# EasyEDA Pro project ProPrj_DiscoTech 6 Current_2026-05-06.epro, schematic Control_Manual_Mute

## Sheets
1 P1: Board Name: Control_Manual_Mute; Create Date: 2026-05-04; Page Name: P1; Project Name: DiscoTech 6 Current; Schematic Name: Control_1; Update Date: 2026-05-04; Company: EasyEDA.com; Page Size: A4; Version: V1.0
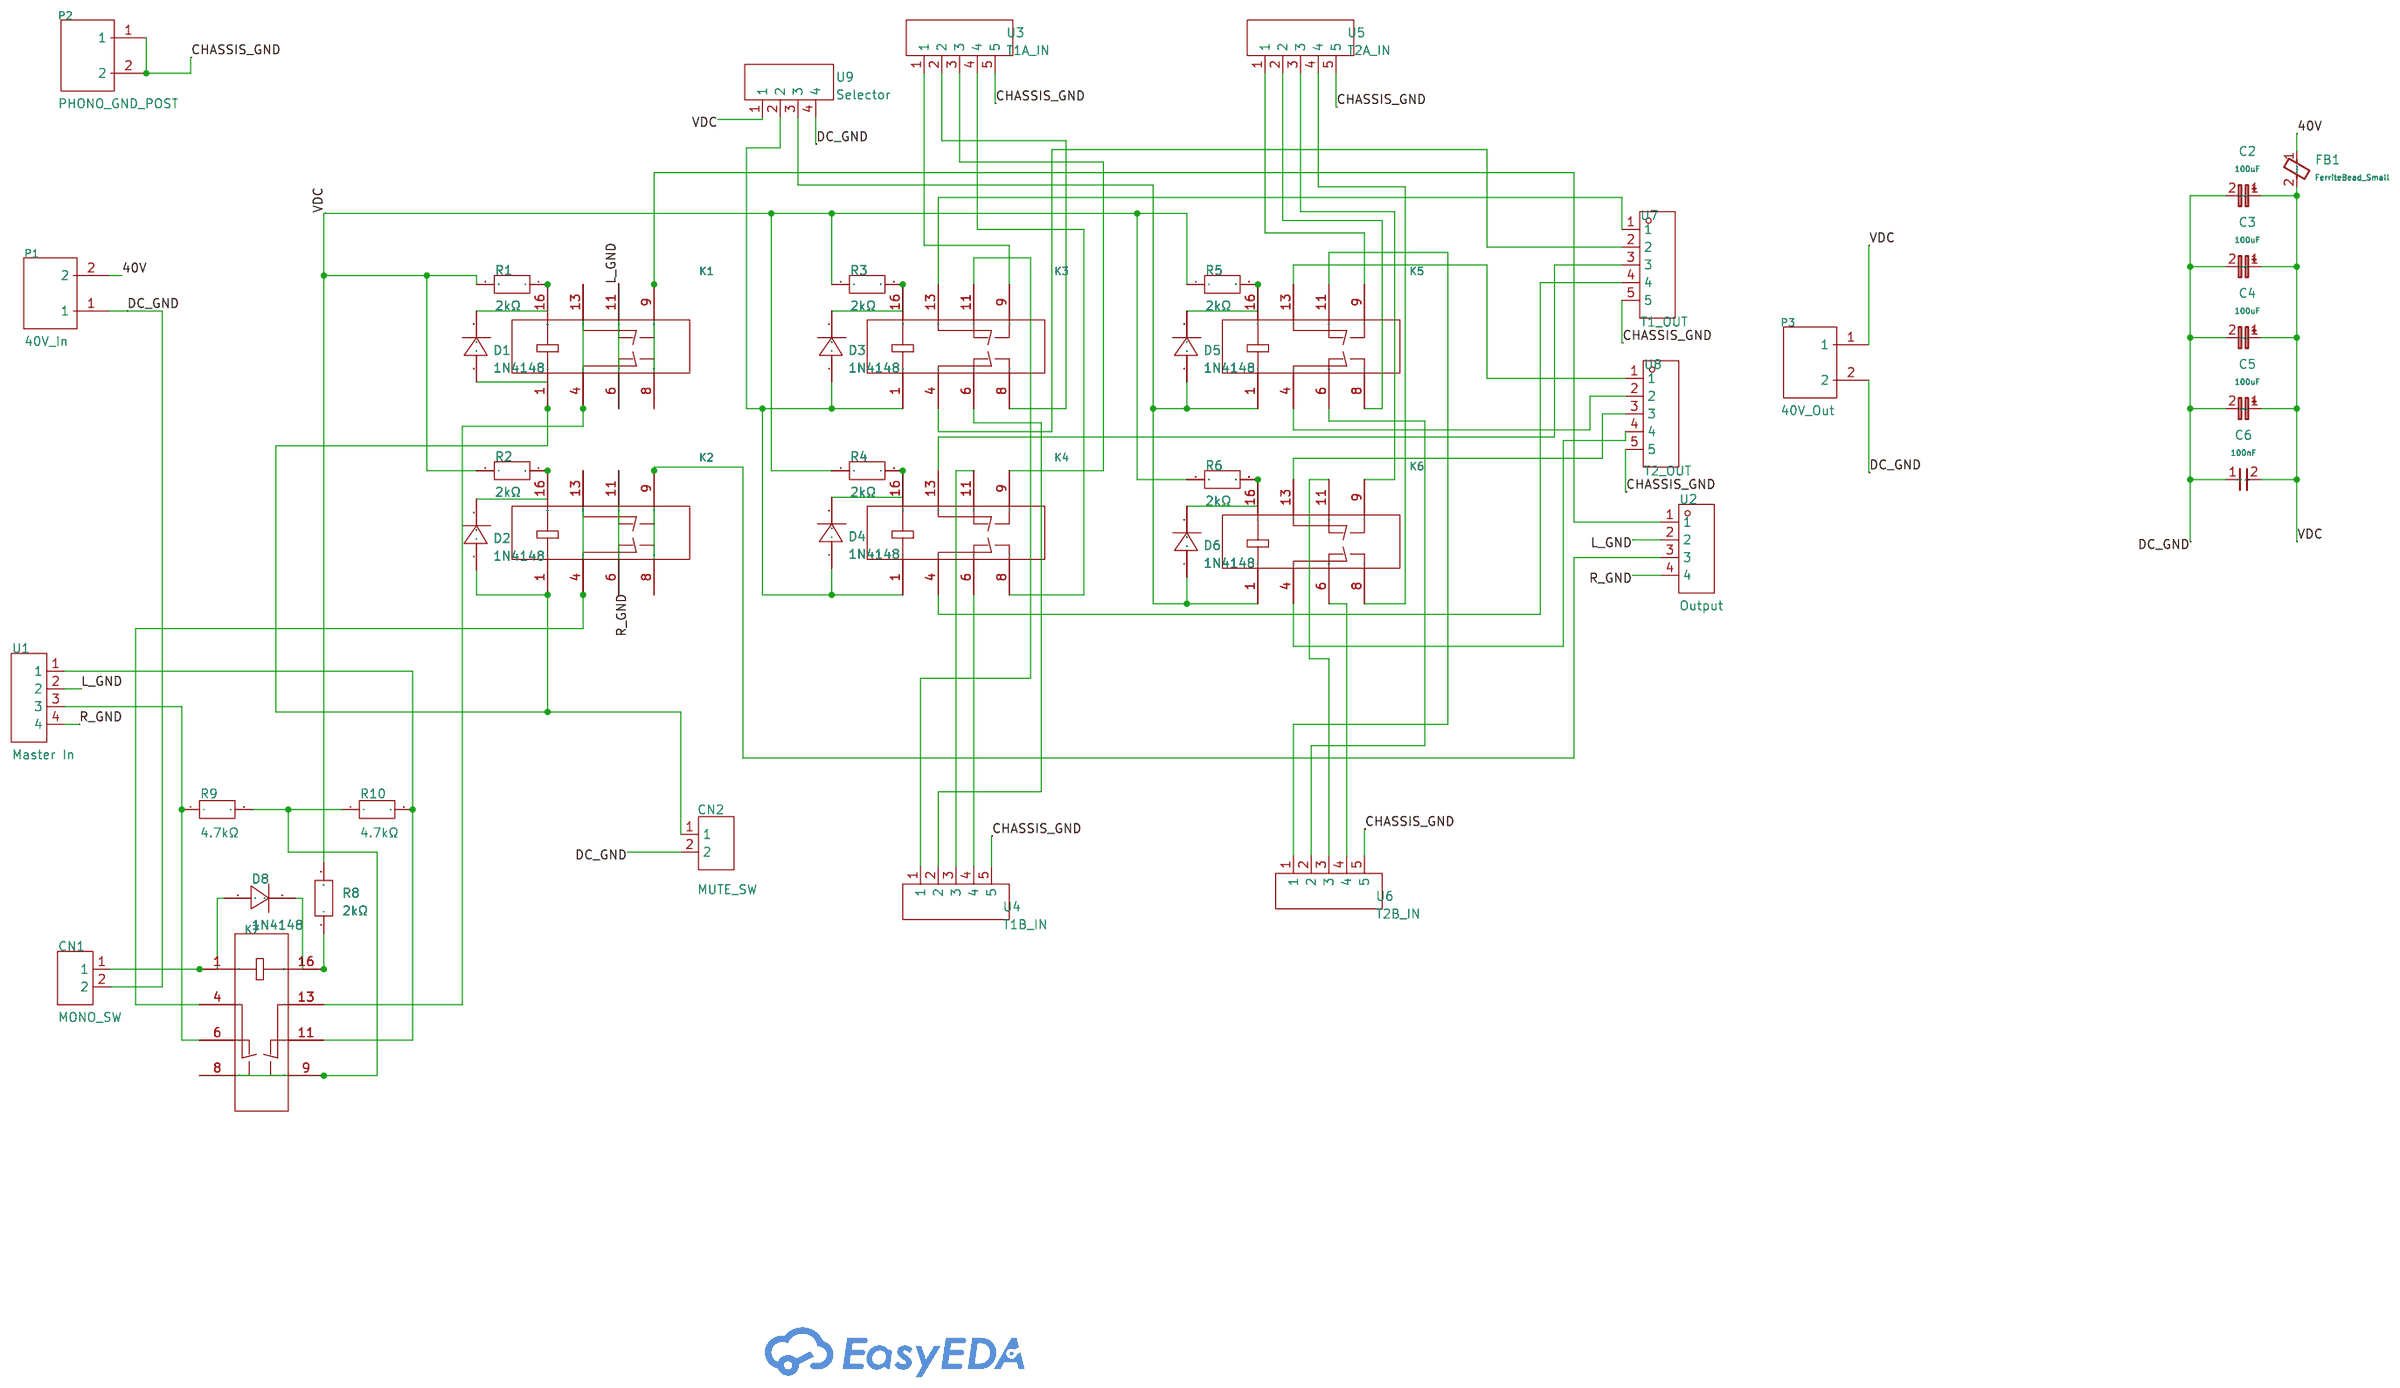
[diagram p2: P1]
2 P2: Board Name: Relay; Create Date: 2026-03-06; Page Name: P2; Project Name: Bozak Clone Rev 7; Schematic Name: Relay; Update Date: 2026-03-06
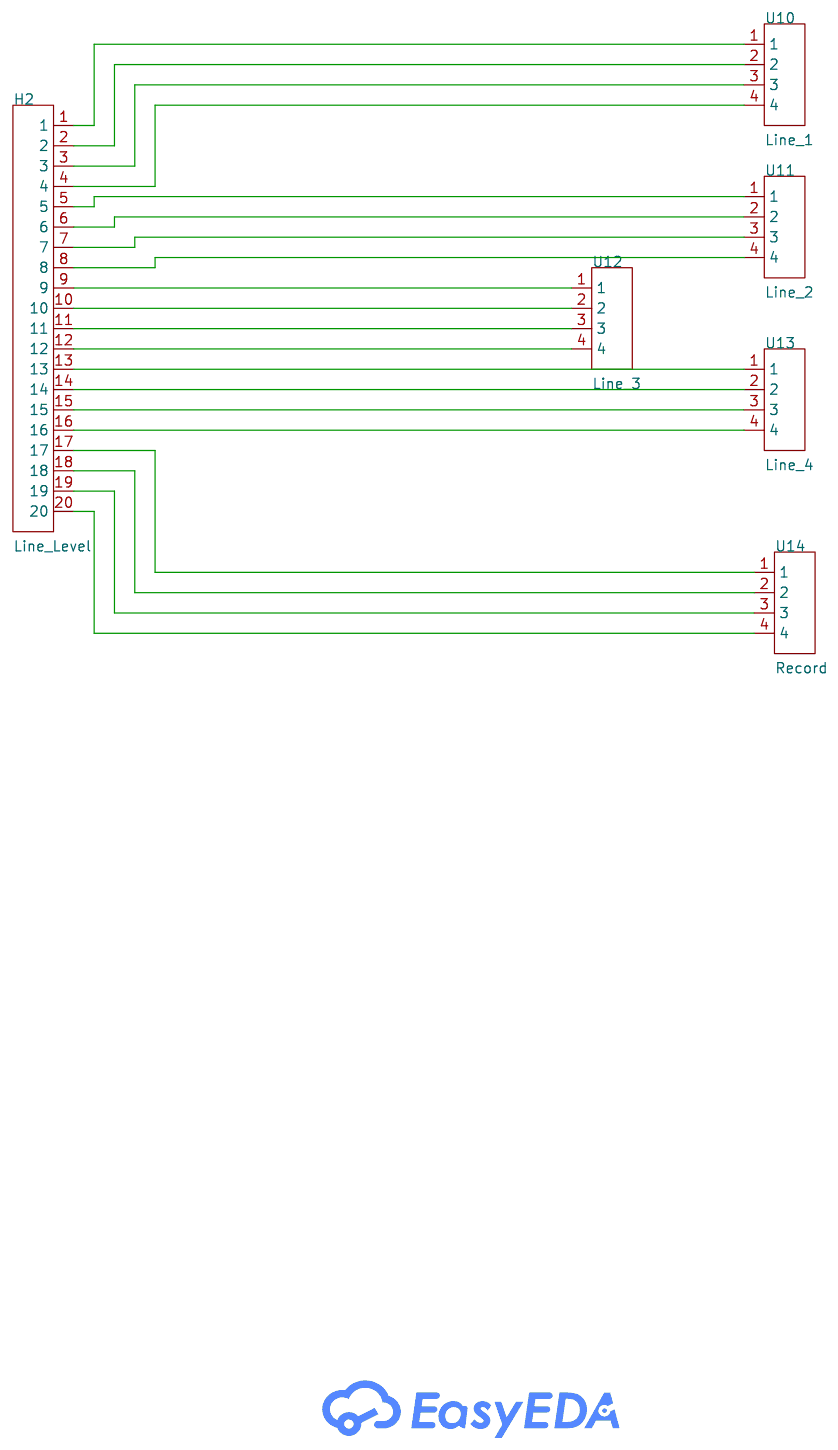
[diagram p3: P2]

## Parts
sheet P1
C2  100uF  [Capacitor_THT:CP_Radial_D10.0mm_P5.00mm]
C3  100uF  [Capacitor_THT:CP_Radial_D10.0mm_P5.00mm]
C4  100uF  [Capacitor_THT:CP_Radial_D10.0mm_P5.00mm]
C5  100uF  [Capacitor_THT:CP_Radial_D10.0mm_P5.00mm]
C6  100nF  [Capacitor_THT:C_Rect_L7.2mm_W2.5mm_P5.00mm_FKS2_FKP2_MKS2_MKP2]
CN1  MONO_SW  [CONN-TH_2P-P2.50_HX-2.54MM-2P-ZZ-MS]
CN2  MUTE_SW  [CONN-TH_2P-P2.50_HX-2.54MM-2P-ZZ-MS]
D1  1N4148  [DO-35_BD2.0-L4.0-P8.00-D0.5-FD]
D2  1N4148  [DO-35_BD2.0-L4.0-P8.00-D0.5-FD]
D3  1N4148  [DO-35_BD2.0-L4.0-P8.00-D0.5-FD]
D4  1N4148  [DO-35_BD2.0-L4.0-P8.00-D0.5-FD]
D5  1N4148  [DO-35_BD2.0-L4.0-P8.00-D0.5-FD]
D6  1N4148  [DO-35_BD2.0-L4.0-P8.00-D0.5-FD]
D8  1N4148  [DO-35_BD2.0-L4.0-P8.00-D0.5-FD]
FB1  FerriteBead_Small  [Inductor_THT:L_Axial_L9.5mm_D4.0mm_P12.70mm_Horizontal_Fastron_SMCC]
K1  G5V-2-H1 DC24  [RELAY-TH_G5V-2]
K2  G5V-2-H1 DC24  [RELAY-TH_G5V-2]
K3  G5V-2-H1 DC24  [RELAY-TH_G5V-2]
K4  G5V-2-H1 DC24  [RELAY-TH_G5V-2]
K5  G5V-2-H1 DC24  [RELAY-TH_G5V-2]
K6  G5V-2-H1 DC24  [RELAY-TH_G5V-2]
K7  G5V-2-H1 DC24  [RELAY-TH_G5V-2]
P1  40V_In  [CONN-TH_WJ126V-5.0-2P]
P2  PHONO_GND_POST  [HDR-TH_P5.00-V-M]
P3  40V_Out  [CONN-TH_WJ126V-5.0-2P]
R1  2kΩ  [RES-TH_BD4.5-L11.5-P15.00-D0.8]
R2  2kΩ  [RES-TH_BD4.5-L11.5-P15.00-D0.8]
R3  2kΩ  [RES-TH_BD4.5-L11.5-P15.00-D0.8]
R4  2kΩ  [RES-TH_BD4.5-L11.5-P15.00-D0.8]
R5  2kΩ  [RES-TH_BD4.5-L11.5-P15.00-D0.8]
R6  2kΩ  [RES-TH_BD4.5-L11.5-P15.00-D0.8]
R8  2kΩ  [RES-TH_BD4.5-L11.5-P15.00-D0.8]
R9  4.7kΩ  [RES-TH_BD2.4-L6.3-P10.30-D0.6]
R10  4.7kΩ  [RES-TH_BD2.4-L6.3-P10.30-D0.6]
U1  Master In  [CONN-TH_4P-P2.50-XH2.54-4P]
U2  Output  [HDR-TH_4P-P2.54-V-M]
U3  T1A_IN  [HDR-TH_5P-P2.54-V-M]
U4  T1B_IN  [HDR-TH_5P-P2.54-V-M]
U5  T2A_IN  [HDR-TH_5P-P2.54-V-M]
U6  T2B_IN  [HDR-TH_5P-P2.54-V-M]
U7  T1_OUT  [CONN-TH_5P-P2.50_ZX-XH2.54-5PZZ]
U8  T2_OUT  [CONN-TH_5P-P2.50_ZX-XH2.54-5PZZ]
U9  Selector  [CONN-TH_4P-P2.50-XH2.54-4P]
sheet P2
H2  Line_Level  [HDR-TH_20P-P2.54-V-M_4]
U10  Line_1  [CONN-TH_4P-P2.50-XH2.54-4P]
U11  Line_2  [CONN-TH_4P-P2.50-XH2.54-4P]
U12  Line_3  [CONN-TH_4P-P2.50-XH2.54-4P]
U13  Line_4  [CONN-TH_4P-P2.50-XH2.54-4P]
U14  Record  [CONN-TH_4P-P2.50-XH2.54-4P]

## Library data of the parts
C2-C5 = Device_C_Polarized_Small: Polarized capacitor, small symbol; Users: REF**
C6 = Device_C_Small: Unpolarized capacitor, small symbol; Users: REF**
CN1 CN2 = HX-XH2.54-2PZZ: Pins Structure:1x2P Pitch:2.54mm Mounting Type:Straight Reference Series:XH Number of Pins:2P Number of Rows:1 Number of PINs Per Row:2 Row Spacing:- Current Rating:3A Contact Material:Brass Contact Plating:Tin Operating Temperature:-25℃~+85℃ Operating Te; LCSC Part Name: 1x2P 间距:2.5mm 直插 系列:XH; Supplier Part: C42391660; Manufacturer: hanxia(韩下); Supplier Footprint: 插件,P=2.5mm; JLCPCB Part Class: Extended Part; Datasheet: https://item.szlcsc.com/datasheet/HX-XH2.54-2PZZ/44326932.html; Supplier: LCSC; Pins Structure: 1x2P; Pitch: 2.54mm; Mounting Type: Straight; Reference Series: XH; Number of Pins: 2P; Number of Rows: 1; Number of PINs Per Row: 2; Current Rating: 3A; Contact Material: Brass; Contact Plating: Tin; Operating Temperature: -25℃~+85℃; Voltage Rating: 250V; Plastic Material: PA66; Flame Retardant Rating: UL94V-0; Color: White
D1-D6 D8 = 1N4148_C14516: Diode Configuration:- Voltage - Forward(Vf@If):1V@10mA Voltage - DC Reverse(Vr):75V Current - Rectified:200mA Pd - Power Dissipation:500mW Reverse Leakage Current (Ir):5uA@75V Reverse Recovery Time (trr):4ns Operating Junction Temperature Range:- Operatin; LCSC Part Name: 75V 200mA; Supplier Part: C14516; Manufacturer: ST(先科); Supplier Footprint: DO-35; JLCPCB Part Class: Extended Part; Datasheet: https://item.szlcsc.com/datasheet/1N4148/15180.html; Supplier: LCSC; Voltage - Forward(Vf@If): 1V@10mA; Voltage - DC Reverse(Vr): 75V; Current - Rectified: 200mA; Pd - Power Dissipation: 500mW; Reverse Leakage Current (Ir): 5uA@75V; Reverse Recovery Time (trr): 4ns; Non-Repetitive Peak Forward Surge Current: 4A
FB1 = Device_FerriteBead_Small: Ferrite bead, small symbol; Users: REF**
K1-K7 = G5V-2-H1 DC24: Coil Voltage:24V Contact Form:Two groups of conversions: 2C(Double-pole double-throw conversion) Number of Pins:- Contact Rating:500mA@125VAC；2A@30VDC Switching Voltage(Max):125V@AC；125V@DC Contact Material:Silver + Gold Plated Coil Rated Power:200mW Coil; LCSC Part Name: 24V 1A 两组转换:2C(双刀双掷转换); Supplier Part: C397231; Manufacturer: OMRON(欧姆龙); Supplier Footprint: DIP,20.5x10.1mm; JLCPCB Part Class: Extended Part; Datasheet: https://item.szlcsc.com/datasheet/G5V-2-H1%2520DC24/378768.html; Supplier: LCSC; Coil Voltage: 24V; Contact Form: Two groups of conversions: 2C(Double-pole double-throw conversion); Contact Rating: 500mA@125VAC；2A@30VDC; Switching Voltage(Max): 125V@AC；125V@DC; Contact Material: Silver + Gold Plated; Coil Rated Power: 200mW; Coil Resistance: 2.88kΩ; Switching Current(Max): 1A; Operate Time: 7ms; Release Time: 3ms; Contact Resistance: 100mΩ; Operating Temperature: -25℃~+70℃
P1-P3 = WJ126V-5.0-2P: Structure:1x2P Pitch:5mm Color:Green Mounting Style:Straight Current Rating (Max):18A Voltage Rating (Max):250V Number of Pins:2P Number of Rows:1 Wire Gauge - AWG:14~26 Wire Gauge - AWG:14~26 Wire Gauge - mm2:2.5 Wire Gauge - mm2:2.5 Number of PINs Per R; LCSC Part Name: 5mm 1x2P 排数:1 每排P数:2 直插; Supplier Part: C8404; Manufacturer: KANGNEX(康奈克斯电气); Supplier Footprint: 插件,P=5mm; JLCPCB Part Class: Extended Part; Datasheet: https://atta.szlcsc.com/upload/public/pdf/source/20191225/C8404_8F52D87DF851D149A4DEA9BD9FA83F9A.pdf; Supplier: LCSC; Structure: 1x2P; Pitch: 5mm; Color: Green; Mounting Style: Straight; Current Rating (Max): 18A; Voltage Rating (Max): 250V; Number of Pins: 2P; Number of Rows: 1; Wire Gauge - AWG: 14~26; Wire Gauge - mm2: 2.5; Number of PINs Per Row: 2; Operating Temperature Range: -40℃~+105℃
R1-R6 R8 = RC12KT2K00: Type:碳化物电阻 Resistance: Tolerance:±10% Tolerance:±10% Power(Watts):0.5W Temperature Coefficient:- Temperature Coefficient:- Operating Temperature Range:-55℃~+125℃ Operating Temperature Range:-55℃~+125℃; LCSC Part Name: 碳化物电阻 2kΩ ±10% 500mW; Supplier Part: C2592279; Manufacturer: SEI(Stackpole Electronics Inc.); Supplier Footprint: 插件,D3.6xL9.5mm; JLCPCB Part Class: Extended Part; Datasheet: https://atta.szlcsc.com/upload/public/pdf/source/20210417/3F0563766C2C6FB79319DF07CF82F841.pdf; Supplier: LCSC; Type: 碳化物电阻; Tolerance: ±10%; Power(Watts): 0.5W; Operating Temperature Range: -55℃~+125℃
R9 R10 = MFR-25FBF52-4K7: Type:Metal Film Resistor Resistance:4.7kΩ Tolerance:±1% Tolerance:±1% Power(Watts):250mW Temperature Coefficient:±100ppm/℃ Temperature Coefficient:±100ppm/℃ Operating Temperature:-55℃~+155℃ Operating Temperature:-55℃~+155℃; LCSC Part Name: 金属膜电阻 4.7kΩ ±1% 250mW; Supplier Part: C1371435; Manufacturer: YAGEO(国巨); Supplier Footprint: 插件,D2.4xL6.3mm; JLCPCB Part Class: Extended Part; Datasheet: https://item.szlcsc.com/datasheet/MFR-25FBF52-4K7/1461724.html; Supplier: LCSC; Type: Metal Film Resistor; Tolerance: ±1%; Power(Watts): 250mW; Temperature Coefficient: ±100ppm/℃; Operating Temperature: -55℃~+155℃
U1 U2 U9 = DB125-2.54-4P-GN-S: Number of Positions or Pins:1x4P Pitch:2.54mm Color:Green Mounting Type:Through Hole Number of Pins:4P Number of Rows:1 Number of PINs Per Row:4 Current Rating:7A Voltage Rating (Max):150V Wire Gauge - AWG:18~26 Wire Gauge - AWG:18~26 Wire Gauge - mm2:1 W; LCSC Part Name: 1x4P 2.54mm 直插 排数:1 每排P数:4; Supplier Part: C918122; Manufacturer: DORABO(地博电气); Supplier Footprint: 插件,P=2.54mm; JLCPCB Part Class: Extended Part; Datasheet: https://item.szlcsc.com/datasheet/DB125-2.54-4P-GN-S/993701.html; Supplier: LCSC; Number of Positions or Pins: 1x4P; Pitch: 2.54mm; Color: Green; Mounting Type: Through Hole; Number of Pins: 4P; Number of Rows: 1; Number of PINs Per Row: 4; Current Rating: 7A; Voltage Rating (Max): 150V; Wire Gauge - AWG: 18~26; Wire Gauge - mm2: 1; Operating Temperature: -40℃~+105℃
U3-U8 = XY308-2.54-5P: Number of Positions or Pins:1x5P Pitch:2.54mm Color:Green Mounting Type:Through Hole Number of Pins:5P Number of Rows:1 Number of PINs Per Row:5 Screw Specification:M1.6 Current Rating:6A Voltage Rating (Max):150V Wire Gauge - AWG:18~26 Wire Gauge - mm2:1; LCSC Part Name: 1x5P 2.54mm 直插 排数:1 每排P数:5; Supplier Part: C915914; Manufacturer: XINLAIYA(新莱亚); Supplier Footprint: 插件,P=2.54mm; JLCPCB Part Class: Extended Part; Datasheet: https://item.szlcsc.com/datasheet/XY308-2.54-5P/989796.html; Supplier: LCSC; Number of Positions or Pins: 1x5P; Pitch: 2.54mm; Color: Green; Mounting Type: Through Hole; Number of Pins: 5P; Number of Rows: 1; Number of PINs Per Row: 5; Screw Specification: M1.6; Current Rating: 6A; Voltage Rating (Max): 150V; Wire Gauge - AWG: 18~26; Wire Gauge - mm2: 1
H2 = PH2.54-1X20P-H25: Pin Structure:1x20P Pitch:2.54mm Row Spacing:- Circluar Pins/Square Pins:Pin Header Mounting Type:Through Hole Number of Rows:1 Number of Pins:20P Current Rating:3A Voltage Rating (Max):- Length of Mating Pin:6mm Insulation Height:2.5mm Length of End Conn; LCSC Part Name: 1x20P 间距:2.54mm 方针 直插; Supplier Part: C42431804; Manufacturer: JXTCONN(聚兴泰); Supplier Footprint: 插件,P=2.54mm; JLCPCB Part Class: Extended Part; Datasheet: https://item.szlcsc.com/datasheet/PH2.54-1X20P-H25/44458934.html; Supplier: LCSC; Pin Structure: 1x20P; Pitch: 2.54mm; Circluar Pins/Square Pins: Pin Header; Mounting Type: Through Hole; Number of Rows: 1; Number of Pins: 20P; Current Rating: 3A; Length of Mating Pin: 6mm; Insulation Height: 2.5mm; Length of End Connection Pin: 3mm; Contact Material: Brass; Contact Plating: Gold; Operating Temperature: -40℃~+105℃; Color: Black
U10-U14 = MX128-2.54-04P-GN01-Cu-Y-A: Number of Positions or Pins:1x4P Pitch:2.54mm Color:Green Mounting Type:Direct Insert Number of Pins:4P Number of Rows:1 Number of PINs Per Row:4 Screw Specification:M1.6 Current Rating:6A Voltage Rating (Max):150V Wire Gauge - AWG:18~24 Wire Gauge - AWG:; LCSC Part Name: 1x4P 2.54mm 直插 排数:1 每排P数:4; Supplier Part: C5188444; Manufacturer: MAX(迈旭); Supplier Footprint: 插件,P=2.54mm; JLCPCB Part Class: Extended Part; Datasheet: https://atta.szlcsc.com/upload/public/pdf/source/20250320/39CF67EAC718F5AC600D0D1AE915BA0E.pdf; Supplier: LCSC; Number of Positions or Pins: 1x4P; Pitch: 2.54mm; Color: Green; Mounting Type: Direct Insert; Number of Pins: 4P; Number of Rows: 1; Number of PINs Per Row: 4; Screw Specification: M1.6; Current Rating: 6A; Voltage Rating (Max): 150V; Wire Gauge - AWG: 18~24; Wire Gauge - mm2: 1; Operating Temperature: -40℃~+105℃

## Nets
40V: FB1.1 P1.2
CHASSIS_GND: P2.1 P2.2 U3.5 U4.5 U5.5 U6.5 U7.5 U8.5
DC_GND: C2.2 C3.2 C4.2 C5.2 C6.1 CN1.2 CN2.2 P1.1 P3.2 U9.4
L_GND: K1.6 K1.11 U1.2 U2.2
R_GND: K2.6 K2.11 U1.4 U2.4
VDC: C2.1 C3.1 C4.1 C5.1 C6.2 FB1.2 P3.1 R1.2 R2.1 R3.1 R4.1 R5.1 R6.1 R8.2 U9.1
$1N1234: CN2.1 D1.1(A) D2.1(A) K1.1 K2.1
$1N1275: D5.1(A) D6.1(A) K5.1 K6.1 U9.3
$1N1926: D6.2(C) K6.16 R6.2
$1N1928: D4.2(C) K4.16 R4.2
$1N1930: D2.2(C) K2.16 R2.2
$1N1932: D1.2(C) K1.16 R1.1
$1N1934: D3.2(C) K3.16 R3.2
$1N1936: D5.2(C) K5.16 R5.2
$1N2091: K7.6 R9.1 U1.3
$1N2125: K1.8 K1.9 U2.1
$1N2148: K2.8 K2.9 U2.3
$1N2227: K3.13 U7.1
$1N2231: K5.13 U8.1
$1N2236: K4.13 U7.3
$1N2241: K6.13 U8.3
$1N2971: D3.1(A) D4.1(A) K3.1 K4.1 U9.2
$1N3037: K3.8 U3.2
$1N3042: K4.8 U3.4
$1N3056: K3.6 U4.2
$1N3362: K3.4 U7.2
$1N3371: K4.4 U7.4
$1N3379: K5.4 U8.2
$1N3391: K6.4 U8.4
$1N3414: K3.9 U3.1
$1N3441: K3.11 U4.1
$1N3467: K4.9 U3.3
$1N3491: K4.11 U4.3
$1N3506: K4.6 U4.4
$1N3510: K5.9 U5.1
$1N3516: K5.8 U5.2
$1N3524: K5.11 U6.1
$1N3533: K5.6 U6.2
$1N3544: K6.9 U5.3
$1N3551: K6.8 U5.4
$1N3558: K6.11 U6.3
$1N3565: K6.6 U6.4
$1N6919: D8.2(C) K7.16 R8.1
$1N7000: CN1.1 D8.1(A) K7.1
$1N7087: K7.11 R10.2 U1.1
$1N7239: K7.8 K7.9 R9.2 R10.1
$1N7333: K2.4 K2.13 K7.4
$1N11828: K1.4 K1.13 K7.13
$2N368: H2.1 U10.1
$2N370: H2.2 U10.2
$2N372: H2.3 U10.3
$2N374: H2.4 U10.4
$2N376: H2.5 U11.1
$2N378: H2.6 U11.2
$2N380: H2.7 U11.3
$2N382: H2.8 U11.4
$2N384: H2.9 U12.1
$2N386: H2.10 U12.2
$2N388: H2.11 U12.3
$2N390: H2.12 U12.4
$2N392: H2.13 U13.1
$2N394: H2.14 U13.2
$2N396: H2.15 U13.3
$2N398: H2.16 U13.4
$2N400: H2.17 U14.1
$2N402: H2.18 U14.2
$2N404: H2.19 U14.3
$2N406: H2.20 U14.4
